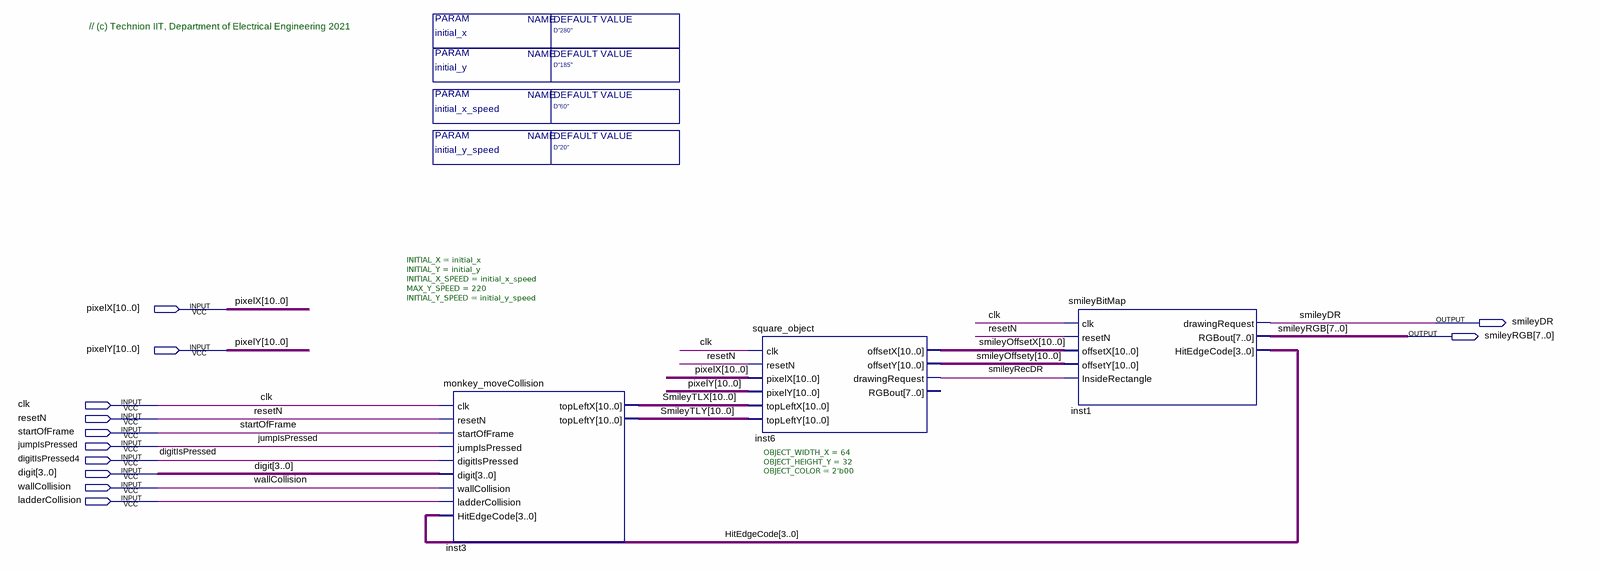
[diagram p0: schematic sheet]
// Quartus schematic Smiley_Block.bdf as structural Verilog: 3 symbols, 12 pins
module Smiley_Block #(parameter initial_x = "D\"280\"", parameter initial_y = "D\"185\"", parameter initial_x_speed = "D\"60\"", parameter initial_y_speed = "D\"20\"") (
  input  [10:0] pixelX,
  input  [10:0] pixelY,
  input  clk,
  input  resetN,
  input  startOfFrame,
  input  jumpIsPressed,
  input  digitIsPressed4,
  input  [3:0] digit,
  input  wallCollision,
  input  ladderCollision,
  output smileyDR,
  output [7:0] smileyRGB
);

  wire smileyRecDR;
  wire [3:0] HitEdgeCode;
  wire [10:0] smileyOffsetX, smileyOffsety, SmileyTLX, SmileyTLY;

  monkey_moveCollision #(.INITIAL_X(initial_x), .INITIAL_Y(initial_y), .INITIAL_X_SPEED(initial_x_speed), .MAX_Y_SPEED(220), .INITIAL_Y_SPEED(initial_y_speed)) inst3 (
    .clk(clk), .resetN(resetN), .startOfFrame(startOfFrame), .jumpIsPressed(jumpIsPressed),
    .digitIsPressed(digitIsPressed4), .digit(digit), .wallCollision(wallCollision),
    .ladderCollision(ladderCollision), .HitEdgeCode(HitEdgeCode), .topLeftX(SmileyTLX), .topLeftY(SmileyTLY));
  square_object #(.OBJECT_WIDTH_X(64), .OBJECT_HEIGHT_Y(32), .OBJECT_COLOR(2'b00)) inst6 (
    .clk(clk), .resetN(resetN), .pixelX(pixelX), .pixelY(pixelY), .topLeftX(SmileyTLX), .topLeftY(SmileyTLY),
    .offsetX(smileyOffsetX), .offsetY(smileyOffsety), .drawingRequest(smileyRecDR));  // open: RGBout
  smileyBitMap inst1 (
    .clk(clk), .resetN(resetN), .offsetX(smileyOffsetX), .offsetY(smileyOffsety),
    .InsideRectangle(smileyRecDR), .drawingRequest(smileyDR), .RGBout(smileyRGB), .HitEdgeCode(HitEdgeCode));

  // Other names for the same wires on the sheet: digitIsPressed = digitIsPressed4

  // Notes on the sheet:
  //   // (c) Technion IIT, Department of Electrical Engineering 2021
endmodule
